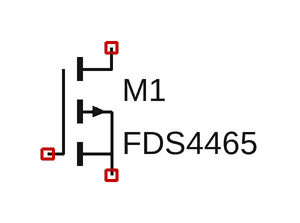
[diagram p0: schematic Draft5.asc]
Draft5.asc, the LTspice schematic file:
Version 4
SHEET 1 880 680
SYMBOL pmos 128 112 R0
SYMATTR InstName M1
SYMATTR Value FDS4465

The netlist it stands for:
* Draft5.asc
M1 NC_01 NC_02 NC_03 NC_03 FDS4465
.model NMOS NMOS
.model PMOS PMOS
.lib standard.mos
.backanno
.end